# Altium schematic sheet PSU12V-250mA-Protection.SchDoc: 12V 250mA Protection
size A3; DrawnBy: Tom Benedetti; DocumentNumber: N/A; Revision: 3; SheetNumber: 1; SheetTotal: 1; Version: 01; Project: QUTMS Common Altium Schematics; PageSetup: Record=PageOptions|CenterHorizontal=True|CenterVertical=True|PrintScale=0.97|XCorrection=1.00|YCorrection=1.00|PrintKind=0|BorderSize=5000000|LeftOffset=0|BottomOffset=0|Orientation=2|PaperLength=1000|PaperWidth=1000|Scale=100|PaperSource=7|PrintQuality=-4|MediaType=1|DitherType=10|PaperKind=A4|PrintScaleMode=1
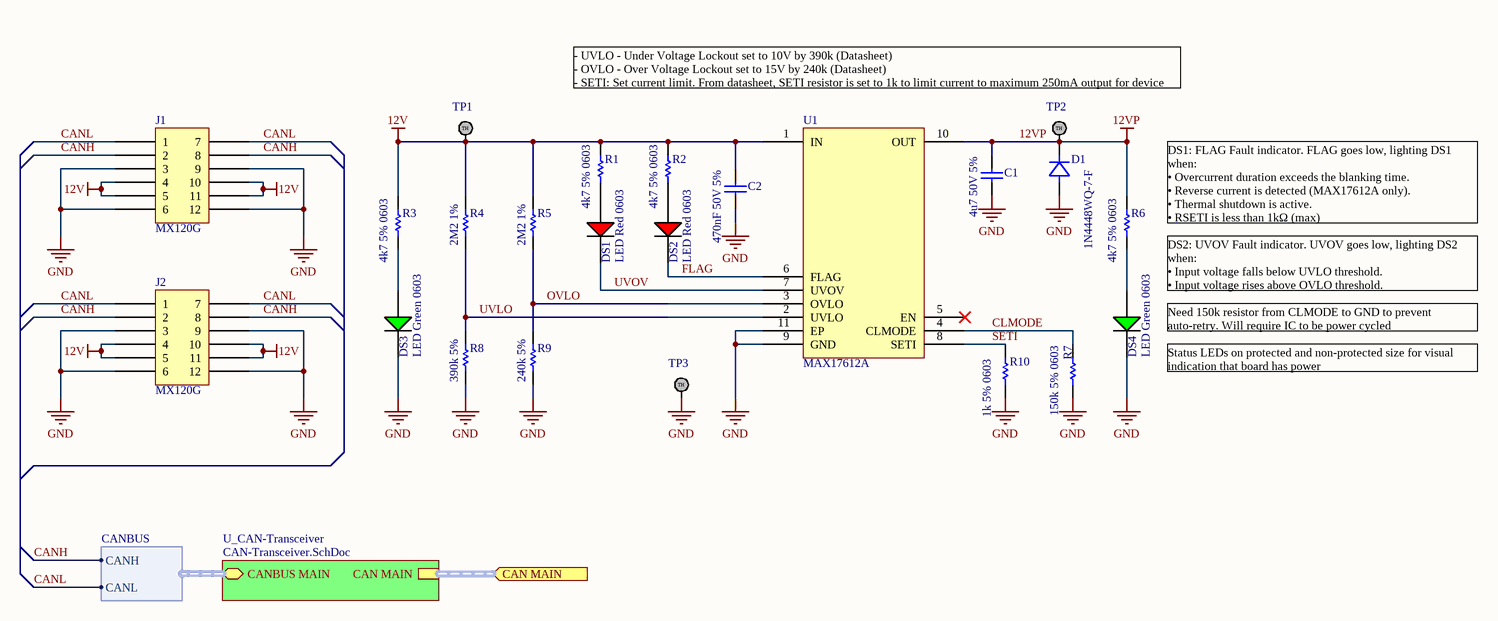
[diagram p0: PSU12V-250mA-Protection.SchDoc]

## Parts
C1  4u7 50V 5%  [Cap_Ceramic_0603]
C2  470nF 50V 5%  [Cap_Ceramic_0603]
D1  1N4448WQ-7-F  [SMA]
DS1  LED Red 0603  [LED RED 0603]
DS2  LED Red 0603  [LED RED 0603]
DS3  LED Green 0603  [LED GREEN 0603]
DS4  LED Green 0603  [LED GREEN 0603]
J1  MX120G  [MX120G]
J2  MX120G  [MX120G]
R1  4k7 5% 0603  [Res_ThinFilm_0603]
R2  4k7 5% 0603  [Res_ThinFilm_0603]
R3  4k7 5% 0603  [Res_ThinFilm_0603]
R4  2M2 1%  [Res_ThinFilm_0603]
R5  2M2 1%  [Res_ThinFilm_0603]
R6  4k7 5% 0603  [Res_ThinFilm_0603]
R7  150k 5% 0603  [Res_ThinFilm_0603]
R8  390k 5%  [Res_ThinFilm_0603]
R9  240k 5%  [Res_ThinFilm_0603]
R10  1k 5% 0603  [Res_ThinFilm_0603]
TP1  TestPoint  [TestPoint]  (value not drawn)
TP2  TestPoint  [TestPoint]  (value not drawn)
TP3  TestPoint  [TestPoint]  (value not drawn)
U1  MAX17612A  [10-Pin TDFN EP]

## Sub-sheets
U_CAN-Transceiver = CAN-Transceiver.SchDoc: CANBUS MAIN (bidir, harness CANBUS), CAN MAIN (harness CAN)

## Ports
CAN MAIN (in)

## Harnesses
CANBUS: CANH, CANL

## Nets
12V: C2.2 J1.4 J1.5 J1.10 J1.11 J2.4 J2.5 J2.10 J2.11 R1.2 R2.2 R3.2 R4.2 R5.2 TP1.1 U1.1(IN)
12VP: C1.2 D1.K(Cathode) R6.2 TP2.1 U1.10(OUT)
GND: C1.1 C2.1 D1.A(Anode) DS3.2(C) DS4.2(C) J1.3 J1.6 J1.9 J1.12 J2.3 J2.6 J2.9 J2.12 R7.1 R8.1 R9.1 R10.1 TP3.1 U1.9(GND) U1.11(EP)
CANH: J1.2 J1.8 J2.2 J2.8 ; sheet U_CAN-Transceiver/CANBUS MAIN.CANH
CANL: J1.1 J1.7 J2.1 J2.7 ; sheet U_CAN-Transceiver/CANBUS MAIN.CANL
CLMODE: R7.2 U1.4(CLMODE)
FLAG: DS2.2(C) U1.6(FLAG)
OVLO: R5.1 R9.2 U1.3(OVLO)
SETI: R10.2 U1.8(SETI)
UVLO: R4.1 R8.2 U1.2(UVLO)
UVOV: DS1.2(C) U1.7(UVOV)
NetDS1_1: DS1.1(A) R1.1
NetDS2_1: DS2.1(A) R2.1
NetDS3_1: DS3.1(A) R3.1
NetDS4_1: DS4.1(A) R6.1

Not connected (* = marked no-connect by the designer): U1 5(EN)*

## Buses and harness runs
harness port CAN MAIN = sheet U_CAN-Transceiver/CAN MAIN

## Notes on the sheet
- - UVLO - Under Voltage Lockout set to 10V by 390k (Datasheet)
  - OVLO - Over Voltage Lockout set to 15V by 240k (Datasheet)
  - SETI: Set current limit. From datasheet, SETI resistor is set to 1k to limit current to maximum 250mA output for device
- (near R6) DS1: FLAG Fault indicator. FLAG goes low, lighting DS1 when:
  • Overcurrent duration exceeds the blanking time.
  • Reverse current is detected (MAX17612A only).
  • Thermal shutdown is active.
  • RSETI is less than 1kΩ (max)
- DS2: UVOV Fault indicator. UVOV goes low, lighting DS2 when:
  • Input voltage falls below UVLO threshold.
  • Input voltage rises above OVLO threshold.
- (near DS4) Need 150k resistor from CLMODE to GND to prevent auto-retry. Will require IC to be power cycled
- (near DS4) Status LEDs on protected and non-protected size for visual indication that board has power
- Revision History:
- Sheet Title:
- Rev
- Date
- Description
- Project:
- Size:
- Drawn By:
- A3
- Number:
- Revision:
- Sheet
- Version:
- of
- QUT Motorsport
- O-120, Gardens Point
- 2 George Street
- Brisbane, QLD 4000
- Australia
- Print Date:
- Print Time:
- File Name:
- (in symbol TestPoint) TH

## Library data of the parts
C1 = 4u7 50V 5% X7R 0603: Capacitor, Ceramic, SMD, 4u7, 50V, 5%, X7R, 0603
C2 = 470nF 50V 5% X7R 0603: Capacitor, Ceramic, SMD, 470nF, 50V, 5%, X7R, 0603
D1 = 1N4448WQ-7-F: Diode, SMD, 75V, 5%, 250mA, SOD123; Manufacturer: ON Semiconductor / Fairchild; Manufacturer Part Number: 1N914BWS; Average Rectified Current: 150mA; Element Configuration: Single; Forward Voltage: 1V; Max Reverse Leakage Current: 5uA; Power Dissipation: 200mW; Recovery Time: 4ns; Max Forward Surge Current (Ifsm): 4A; Parameter 1: *; Weight: 0.0276g; Category: Rectifier Diodes; Contact Plating: Tin,Matte; Forward Current: 150mA; Lead Free: Lead Free; Max Operating Temperature: 150°C; Max Repetitive Reverse Voltage (Vrrm): 75V; Max Reverse Voltage (DC): 75V; Min Operating Temperature: -55°C; Mount: Surface Mount; Number of Pins: 2; Package Quantity: 1; Packaging: Tape and Reel; Peak Reverse Current: 5uA; Radiation Hardening: No; REACH SVHC: No SVHC; Reverse Recovery Time: 4ns; Height: 1mm; Length: 1.8mm; Reverse Voltage: 75V; Width: 1.35mm
J1 J2 = MX120G: MX120G with standard connector layout
R1-R3 R6 = 4k7 5% 0603: Resistor, SMD, 4k7, 0.1W, 5%, 0603
R4 R5 = 2M2 1% 0603: Resistor, SMD, 2M2, 0.125W, 1%, 0603
R7 = 150k 5%, 0603: Resistor, SMD, 150k, 0.1W, 5%, 0603
R8 = 390k 5% 0603: Resistor, SMD, 390k, 0.1W, 5%, 0603
R9 = 240k 5% 0603: Resistor, SMD, 240k, 0.1W, 5%, 0603
R10 = 1k 5% 0603: Resistor, SMD, 1k, 0.1W, 5%, 0603
U1 = MAX17612A: 4.5V to 60V, 250mA Current-Limiter with OV, UV, and Reverse Protection; ComponentLink1Description: Datasheet; ComponentLink1URL: https://datasheets.maximintegrated.com/en/ds/MAX17612A-MAX17612C.pdf